# EAGLE design Monitor2 (EAGLE 7.1.0)
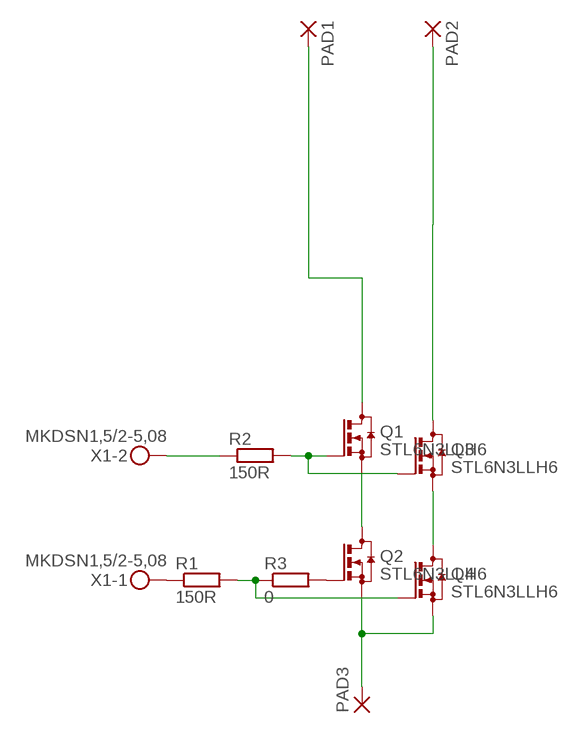
[diagram p0: schematic, sheet 1]

## Parts
PAD1  3,81/1,4  [3,81/1,4]
PAD2  3,81/1,4  [3,81/1,4]
PAD3  3,81/1,4  [3,81/1,4]
Q1  STL6N3LLH6  [POWERFLAT-2X2]
Q2  STL6N3LLH6  [POWERFLAT-2X2]
Q3  STL6N3LLH6  [POWERFLAT-2X2]
Q4  STL6N3LLH6  [POWERFLAT-2X2]
R1  150R  R-EU_R1206  [R1206]
R2  150R  R-EU_R1206  [R1206]
R3  0  R-EU_R1206  [R1206]
X1  MKDSN1,5/2-5,08  [MKDSN1,5/2-5,08]

## Nets
N$1: Q1.4S(S) Q1.S Q2.1D(D) Q2.2D(D) Q2.5D(D) Q2.6D(D) Q2.D
N$2: Q2.3G(G) R3.2
N$3: Q1.3G(G) Q3.3G(G) R2.2
N$4: PAD1.1(P) Q1.1D(D) Q1.2D(D) Q1.5D(D) Q1.6D(D) Q1.D
N$5: PAD3.1(P) Q2.4S(S) Q2.S Q4.4S(S) Q4.S
N$6: R2.1 X1.2
N$7: R1.1 X1.1
N$8: Q4.3G(G) R1.2 R3.1
N$9: PAD2.1(P) Q3.1D(D) Q3.2D(D) Q3.5D(D) Q3.6D(D) Q3.D
N$10: Q3.4S(S) Q3.S Q4.1D(D) Q4.2D(D) Q4.5D(D) Q4.6D(D) Q4.D

## Library data of the parts
PAD1-PAD3 = wirepad:3,81/1,4: THROUGH-HOLE PAD
Q1-Q4 = Namenlos:STL6N3LLH6
R1-R3 = rcl:R-EU_: RESISTOR, European symbol
X1 = con-phoenix-508:MKDSN1,5/2-5,08: MKDSN 1,5/ 2-5,08 Printklemme Nennstrom: 13,5 A Nennspannung: 250 V Rastermaß: 5,08 mm Polzahl: 2 Anschlussart: Schraubanschluss Montage: Löten Anschlussrichtung Leiter/Platine: 0 ° Artikelnummer: 1729128 Source: http://eshop.phoenixcontact.com .. 1729128.pdf

## Board
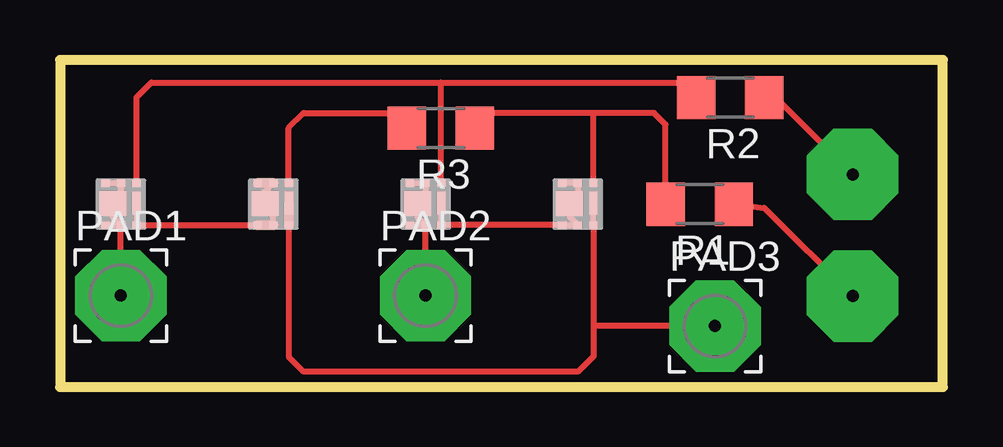
[diagram p1: board, top side]
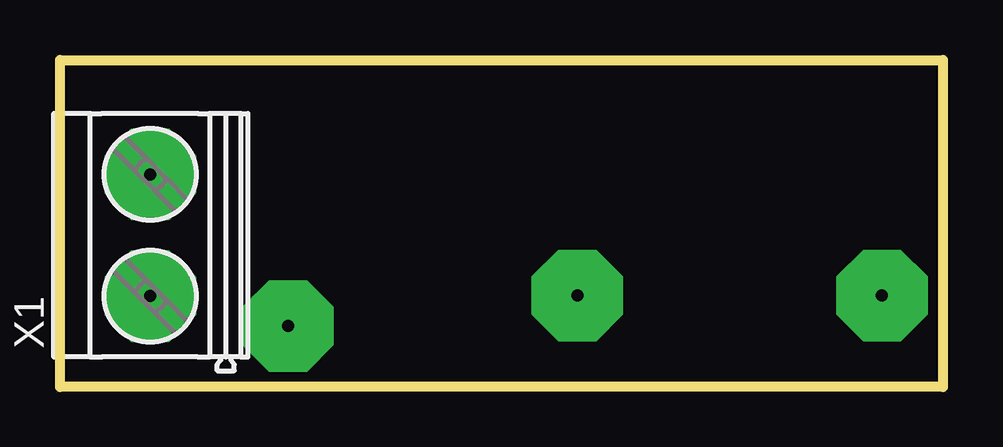
[diagram p2: board, bottom side, seen from below]

Size 36.81 x 13.64 mm. Coordinates in mm from the lower left corner, seen from the top.
Outline: 0,0 36.81,0 36.81,13.64 0,13.64 0,0
Copper layers (1*16): Top 0.035mm / dielectric 1.5mm / Bottom 0.035mm
Design rules "default": minimum track width 10mil, minimum drill 24mil, track to track 8mil, track to pad 8mil, pad to pad 8mil, via to via 8mil, smd to smd 8mil, copper to edge 40mil, drill to drill 8mil, minimum pad ring 10mil, minimum via ring 8mil, stop-mask expansion 4mil, vias tented up to drill 0mil, thermal gap 10mil

### Footprints (pad centres in the part's own frame; a part is rotated, then mirrored left to right if it is on the bottom)
3,81/1,4 = drill 0.5 pad 3.81 octagon: 1 0,0
POWERFLAT-2X2 = smd 0.35 x 0.3: 1D -0.65,0.875; 2D 0,0.875; 3G 0.65,0.875; 4S 0.65,-0.875; 5D 0,-0.875; 6D -0.65,-0.875 | smd 1.125 x 1.05: D -0.34,0.028 | smd 0.35 x 0.95: S 0.65,0.05
R1206 = smd 1.6 x 1.803: 1 -1.422,0; 2 1.422,0
MKDSN1,5/2-5,08 = drill 0.5 pad 3.81 octagon: 1 -2.561,0.025; 2 2.519,0.025

### Placement (x,y rotation side)
PAD1  2.54,3.81 0 top
PAD2  15.24,3.81 0 top
PAD3  27.3,2.54 0 top
Q1  2.54,7.62 0 top
Q2  8.89,7.62 0 top
Q3  15.24,7.62 0 top
Q4  21.59,7.62 0 top
R1  26.67,7.62 180 top
R2  27.94,12.06 180 top
R3  15.88,10.79 180 top
X1  33.02,6.35 90 bottom

### Tracks (layer width: path | path; a pad name or v marks a point on that pad's centre or on a via)
N$1
  Top 0.254: Q1.S Q1.4S Q2.6D | Q2.5D 8.89,7.31 Q2.D 8.55,8.16 Q2.2D
  Top 0.406: Q2.6D Q2.5D | Q2.2D Q2.1D
N$2
  Top 0.254: Q2.3G 9.54,10.81 10.16,11.43 13.97,11.43 13.97,11.28 R3.2
N$3
  Top 0.254: Q1.3G 3.19,12.08 3.81,12.7 15.88,12.7 | 15.88,12.7 25.88,12.7 R2.2 | Q3.3G 15.89,12.68 15.88,12.7
N$4
  Top 0.254: PAD1.1 Q1.5D | Q1.6D Q1.5D | Q1.1D Q1.2D 2.54,7.99 Q1.D 2.2,7.08 Q1.5D
N$5
  Top 0.254: Q4.S Q4.4S 22.24,2.54 | Q2.S 9.54,1.25 10.16,0.63 21.59,0.63 22.24,1.29 22.24,2.54 | PAD3.1 22.24,2.54
  Top 0.406: Q2.S Q2.4S
N$6
  Top 0.254: R2.1 29.85,12.06 X1.2
N$7
  Top 0.254: R1.1 29.36,7.47 X1.1
N$8
  Top 0.254: Q4.3G 22.24,11.41 22.23,11.43 | 22.23,11.43 17.93,11.43 R3.1 | R1.2 25.25,10.95 24.77,11.43 22.23,11.43
N$9
  Top 0.254: Q3.6D Q3.5D | Q3.1D Q3.2D 15.24,7.99 Q3.D 14.9,7.08 Q3.5D | PAD2.1 Q3.5D
N$10
  Top 0.254: Q3.S Q3.4S Q4.6D Q4.5D 21.25,7.08 Q4.D 21.59,7.99 Q4.2D Q4.1D